# Altium schematic sheet BEE_BOARD_CONNECTOR.SchDoc
size Tabloid; SheetNumber: 4; SheetTotal: 6; Sheet_Name: DECAWAVE; Size: 11x17
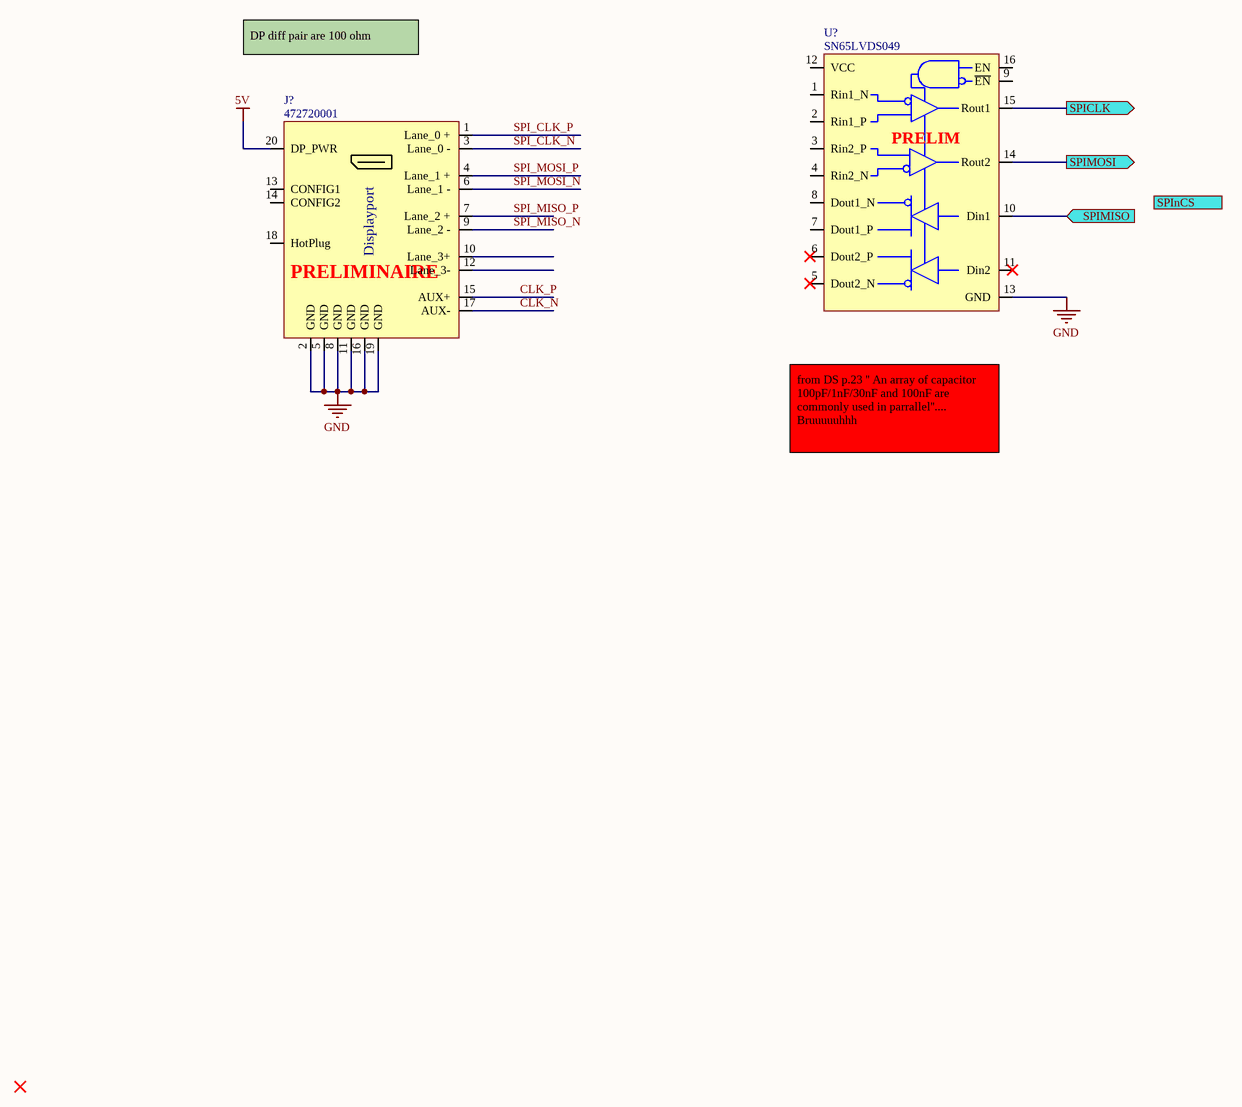
[diagram p0: BEE_BOARD_CONNECTOR.SchDoc]

## Parts
J?  472720001
U?  SN65LVDS049  [COM_TRAN_SN65LVDS049]

## Ports
SPICLK (out), SPIMISO (in), SPIMOSI (out), SPInCS (in)

## Nets
5V: J?.20(DP_PWR)
GND: J?.2(GND) J?.5(GND) J?.8(GND) J?.11(GND) J?.16(GND) J?.19(GND) U?.13(GND)
CLK_N: J?.17(AUX-)
CLK_P: J?.15(AUX+)
SPI_CLK_N: J?.3(Lane_0_-)
SPI_CLK_P: J?.1(Lane_0_+)
SPI_MISO_N: J?.9(Lane_2_-)
SPI_MISO_P: J?.7(Lane_2_+)
SPI_MOSI_N: J?.6(Lane_1_-)
SPI_MOSI_P: J?.4(Lane_1_+)
SPICLK: U?.15(Rout1) ; port SPICLK
SPIMISO: U?.10(Din1) ; port SPIMISO
SPIMOSI: U?.14(Rout2) ; port SPIMOSI

Not connected (* = marked no-connect by the designer): J? 10(Lane_3+) 12(Lane_3-) 13(CONFIG1) 14(CONFIG2) 18(HotPlug); U? 1(Rin1_N) 2(Rin1_P) 3(Rin2_P) 4(Rin2_N) 5(Dout2_N)* 6(Dout2_P)* 7(Dout1_P) 8(Dout1_N) 9(~{EN}) 11(Din2)* 12(VCC) 16(EN)

## Notes on the sheet
- DP diff pair are 100 ohm
- from DS p.23 '' An array of capacitor 100pF/1nF/30nF and 100nF are commonly used in parrallel''.... Bruuuuuhhh
- Sheet Name
- Project Title
- Global Project
- Size
- Group
- Revision
- Date
- Sheet
- of
- Filename
- Designers
- (in symbol COM_TRAN_SN65LVDS049) PRELIM
- (in symbol CON_DP_472720001) Displayport; PRELIMINAIRE

## Library data of the parts
J? = CON_DP_472720001: DisplayPort - Receptacle Connector 20 Position Surface Mount, Right Angle; Through Hole; Manufacturer #1: Molex; Value: RA; Voltage Rating: 16V/40VAC; Current Rating: 500mA per contact; GRAMS Lib Spec: 2.7; Magnetic Material: Unknown; Polarized: Yes; HelpURL: https://www.molex.com/pdm_docs/sd/472720001_sd.pdf; CreatedBy/Date: Philippe Arsenault/2021-03-19; Temperature: -20°C ~ 85°C; Package: 20 pin Displayport; Assembly Type: TH; Part Number #1: 472720001; Supplier 1: Digi-Key; Supplier Part Number 1: WM19271CT-ND
U? = COM_TRAN_SN65LVDS049: 2/2 Transceiver Full LVDS 16-TSSOP; Manufacturer #1: Texas Instruments; Voltage Rating: -0.3V to 4V; Current Rating: 35mA; Power Max: 140mW; GRAMS Lib Spec: 2.7; Note: Could be replaced by DS90LV049; Magnetic Material: Unknown; Polarized: Yes; HelpURL: https://www.ti.com/lit/ds/symlink/sn65lvds049.pdf?HQS=dis-dk-null-digikeymode-dsf-pf-null-wwe&ts=1616618236279; CreatedBy/Date: Philippe Arsenault/2021-03-24; Temperature: -40°C ~ 85°C; Package: 16-TSSOP; Assembly Type: SMT; Part Number #1: SN65LVDS049; Supplier 1: Digi-Key; Supplier Part Number 1: 296-26358-1-ND